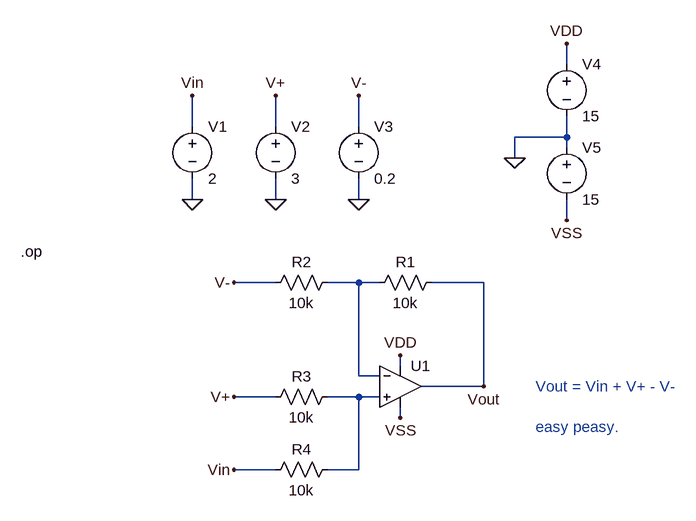
[diagram p0: schematic SensorOffsetAmplifier.asc]
SensorOffsetAmplifier.asc, the LTspice schematic file:
Version 4
SHEET 1 880 680
WIRE 480 -352 480 -384
WIRE -96 -256 -96 -304
WIRE 32 -256 32 -304
WIRE 160 -256 160 -304
WIRE 480 -240 480 -272
WIRE 480 -240 400 -240
WIRE 480 -224 480 -240
WIRE 400 -208 400 -240
WIRE -96 -144 -96 -176
WIRE 32 -144 32 -176
WIRE 160 -144 160 -176
WIRE 480 -112 480 -144
WIRE 32 -16 -32 -16
WIRE 160 -16 112 -16
WIRE 192 -16 160 -16
WIRE 352 -16 272 -16
WIRE 224 112 224 96
WIRE 160 128 160 -16
WIRE 192 128 160 128
WIRE 352 144 352 -16
WIRE 352 144 256 144
WIRE 32 160 -32 160
WIRE 160 160 112 160
WIRE 192 160 160 160
WIRE 224 192 224 176
WIRE 32 272 -32 272
WIRE 160 272 160 160
WIRE 160 272 112 272
FLAG -96 -144 0
FLAG -96 -304 Vin
FLAG 32 -144 0
FLAG 32 -304 V+
FLAG 160 -144 0
FLAG 160 -304 V-
FLAG -32 -16 V-
FLAG -32 160 V+
FLAG -32 272 Vin
FLAG 224 96 VDD
FLAG 224 192 VSS
FLAG 480 -384 VDD
FLAG 480 -112 VSS
FLAG 400 -208 0
FLAG 352 144 Vout
SYMBOL OpAmps\\UniversalOpAmp2 224 144 R0
SYMATTR InstName U1
SYMBOL res 288 -32 R90
WINDOW 0 0 56 VBottom 2
WINDOW 3 32 56 VTop 2
SYMATTR InstName R1
SYMATTR Value 10k
SYMBOL res 128 -32 R90
WINDOW 0 0 56 VBottom 2
WINDOW 3 32 56 VTop 2
SYMATTR InstName R2
SYMATTR Value 10k
SYMBOL res 128 144 R90
WINDOW 0 0 56 VBottom 2
WINDOW 3 32 56 VTop 2
SYMATTR InstName R3
SYMATTR Value 10k
SYMBOL res 128 256 R90
WINDOW 0 0 56 VBottom 2
WINDOW 3 32 56 VTop 2
SYMATTR InstName R4
SYMATTR Value 10k
SYMBOL voltage -96 -272 R0
WINDOW 123 0 0 Left 0
WINDOW 39 0 0 Left 0
SYMATTR InstName V1
SYMATTR Value 2
SYMBOL voltage 32 -272 R0
SYMATTR InstName V2
SYMATTR Value 3
SYMBOL voltage 160 -272 R0
SYMATTR InstName V3
SYMATTR Value 0.2
SYMBOL voltage 480 -368 R0
SYMATTR InstName V4
SYMATTR Value 15
SYMBOL voltage 480 -240 R0
SYMATTR InstName V5
SYMATTR Value 15
TEXT -360 -64 Left 2 !.op
TEXT 432 144 Left 2 ;Vout = Vin + V+ - V-\n \neasy peasy.

The netlist it stands for:
* SensorOffsetAmplifier.asc
XU1 N002 N001 VDD VSS Vout level2 Avol=1Meg GBW=10Meg Slew=10Meg Ilimit=25m Rail=0 Vos=0 En=0 Enk=0 In=0 Ink=0 Rin=500Meg  ; pins In+ In- V+ V- OUT
R1 Vout N001 10k
R2 N001 V- 10k
R3 N002 V+ 10k
R4 N002 Vin 10k
V1 Vin 0 2
V2 V+ 0 3
V3 V- 0 0.2
V4 VDD 0 15
V5 0 VSS 15
.op
* Vout = Vin + V+ - V-
* easy peasy.
.lib UniversalOpAmp2.lib
.backanno
.end